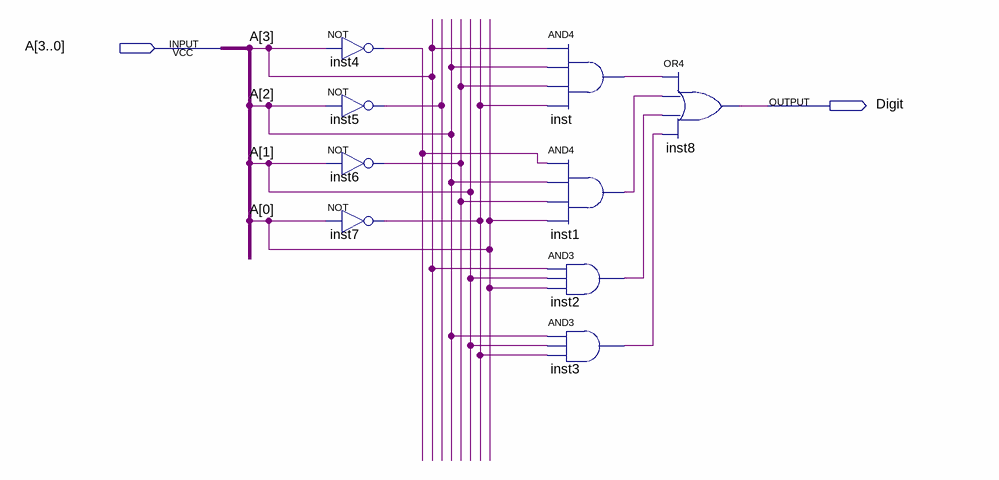
[diagram p0: schematic sheet]
// Quartus schematic sevensegment1.bdf as structural Verilog: 9 symbols, 2 pins
module sevensegment1 (
  input  [3:0] A,
  output Digit
);

  wire inst1_out, inst2_out, inst3_out, inst4_out, inst5_out, inst6_out, inst7_out, inst_out;

  not inst4 (inst4_out, A[3]);
  not inst5 (inst5_out, A[2]);
  not inst6 (inst6_out, A[1]);
  not inst7 (inst7_out, A[0]);
  and inst (inst_out, A[3], A[2], inst6_out, inst7_out);
  and inst1 (inst1_out, inst4_out, A[2], inst6_out, A[0]);
  and inst2 (inst2_out, A[3], A[1], A[0]);
  and inst3 (inst3_out, A[2], A[1], inst7_out);
  or inst8 (Digit, inst_out, inst1_out, inst2_out, inst3_out);
endmodule
